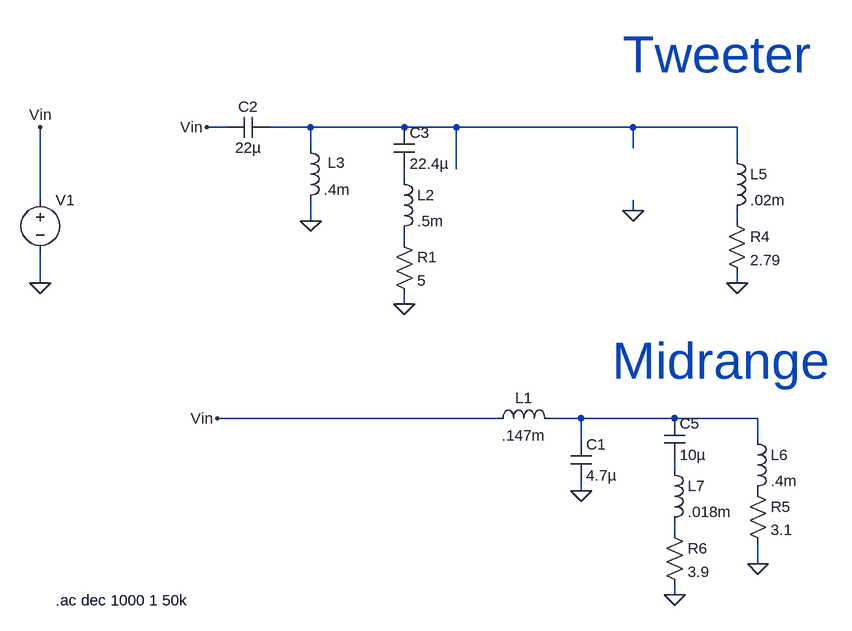
[diagram p0: schematic Crossover Design.asc]
Crossover Design.asc, the LTspice schematic file:
Version 4
SHEET 1 948 992
WIRE 0 64 -32 64
WIRE 128 64 64 64
WIRE 272 64 128 64
WIRE 352 64 272 64
WIRE 624 64 352 64
WIRE 784 64 624 64
WIRE 128 96 128 64
WIRE 624 96 624 64
WIRE 784 112 784 64
WIRE 352 128 352 64
WIRE 272 144 272 128
WIRE -288 176 -288 64
WIRE 624 192 624 176
WIRE 128 208 128 176
WIRE 784 208 784 192
WIRE 272 240 272 224
WIRE -288 304 -288 256
WIRE 784 304 784 288
WIRE 272 336 272 320
WIRE 416 512 -16 512
WIRE 544 512 496 512
WIRE 688 512 544 512
WIRE 816 512 688 512
WIRE 544 544 544 512
WIRE 816 544 816 512
WIRE 688 592 688 576
WIRE 544 624 544 608
WIRE 688 688 688 672
WIRE 816 736 816 704
WIRE 688 784 688 768
FLAG 624 192 0
FLAG 128 208 0
FLAG 784 304 0
FLAG -288 304 0
FLAG 544 624 0
FLAG 816 736 0
FLAG -288 64 Vin
FLAG -32 64 Vin
FLAG -16 512 Vin
FLAG 688 784 0
FLAG 272 336 0
SYMBOL cap 528 544 R0
SYMATTR InstName C1
SYMATTR Value 4.7µ
SYMBOL cap 64 48 R90
WINDOW 0 0 32 VBottom 2
WINDOW 3 32 32 VTop 2
SYMATTR InstName C2
SYMATTR Value 22µ
SYMBOL res 768 192 R0
SYMATTR InstName R4
SYMATTR Value 2.79
SYMBOL res 800 608 R0
SYMATTR InstName R5
SYMATTR Value 3.1
SYMBOL ind 400 528 R270
WINDOW 0 32 56 VTop 2
WINDOW 3 5 56 VBottom 2
SYMATTR InstName L1
SYMATTR Value .147m
SYMATTR SpiceLine Rser=.5
SYMBOL ind 112 80 R0
WINDOW 0 42 38 Left 2
SYMATTR InstName L3
SYMATTR Value .4m
SYMATTR SpiceLine Rser=.5
SYMBOL ind 768 96 R0
SYMATTR InstName L5
SYMATTR Value .02m
SYMBOL ind 800 528 R0
SYMATTR InstName L6
SYMATTR Value .4m
SYMBOL voltage -288 160 R0
SYMATTR InstName V1
SYMATTR Value ""
SYMATTR Value2 AC 1
SYMBOL res 672 672 R0
SYMATTR InstName R6
SYMATTR Value 3.9
SYMBOL cap 672 512 R0
SYMATTR InstName C5
SYMATTR Value 10µ
SYMBOL ind 672 576 R0
SYMATTR InstName L7
SYMATTR Value .018m
SYMATTR SpiceLine Rser=.21
SYMBOL res 256 224 R0
SYMATTR InstName R1
SYMATTR Value 5
SYMBOL cap 256 64 R0
SYMATTR InstName C3
SYMATTR Value 22.4µ
SYMBOL ind 256 128 R0
SYMATTR InstName L2
SYMATTR Value .5m
SYMATTR SpiceLine Rser=.5
TEXT -264 792 Left 2 !.ac dec 1000 1 50k
TEXT 608 -48 Left 6 ;Tweeter
TEXT 592 424 Left 6 ;Midrange

The netlist it stands for:
* Crossover Design.asc
C1 N005 0 4.7µ
C2 N001 Vin 22µ
R4 N003 0 2.79
R5 P001 0 3.1
L1 Vin N005 .147m Rser=.5
L3 N001 0 .4m Rser=.5
L5 N001 N003 .02m
L6 N005 P001 .4m
V1 Vin 0 AC 1
R6 N007 0 3.9
C5 N005 N006 10µ
L7 N006 N007 .018m Rser=.21
R1 N004 0 5
C3 N001 N002 22.4µ
L2 N002 N004 .5m Rser=.5
.ac dec 1000 1 50k
* Tweeter
* Midrange
.backanno
.end